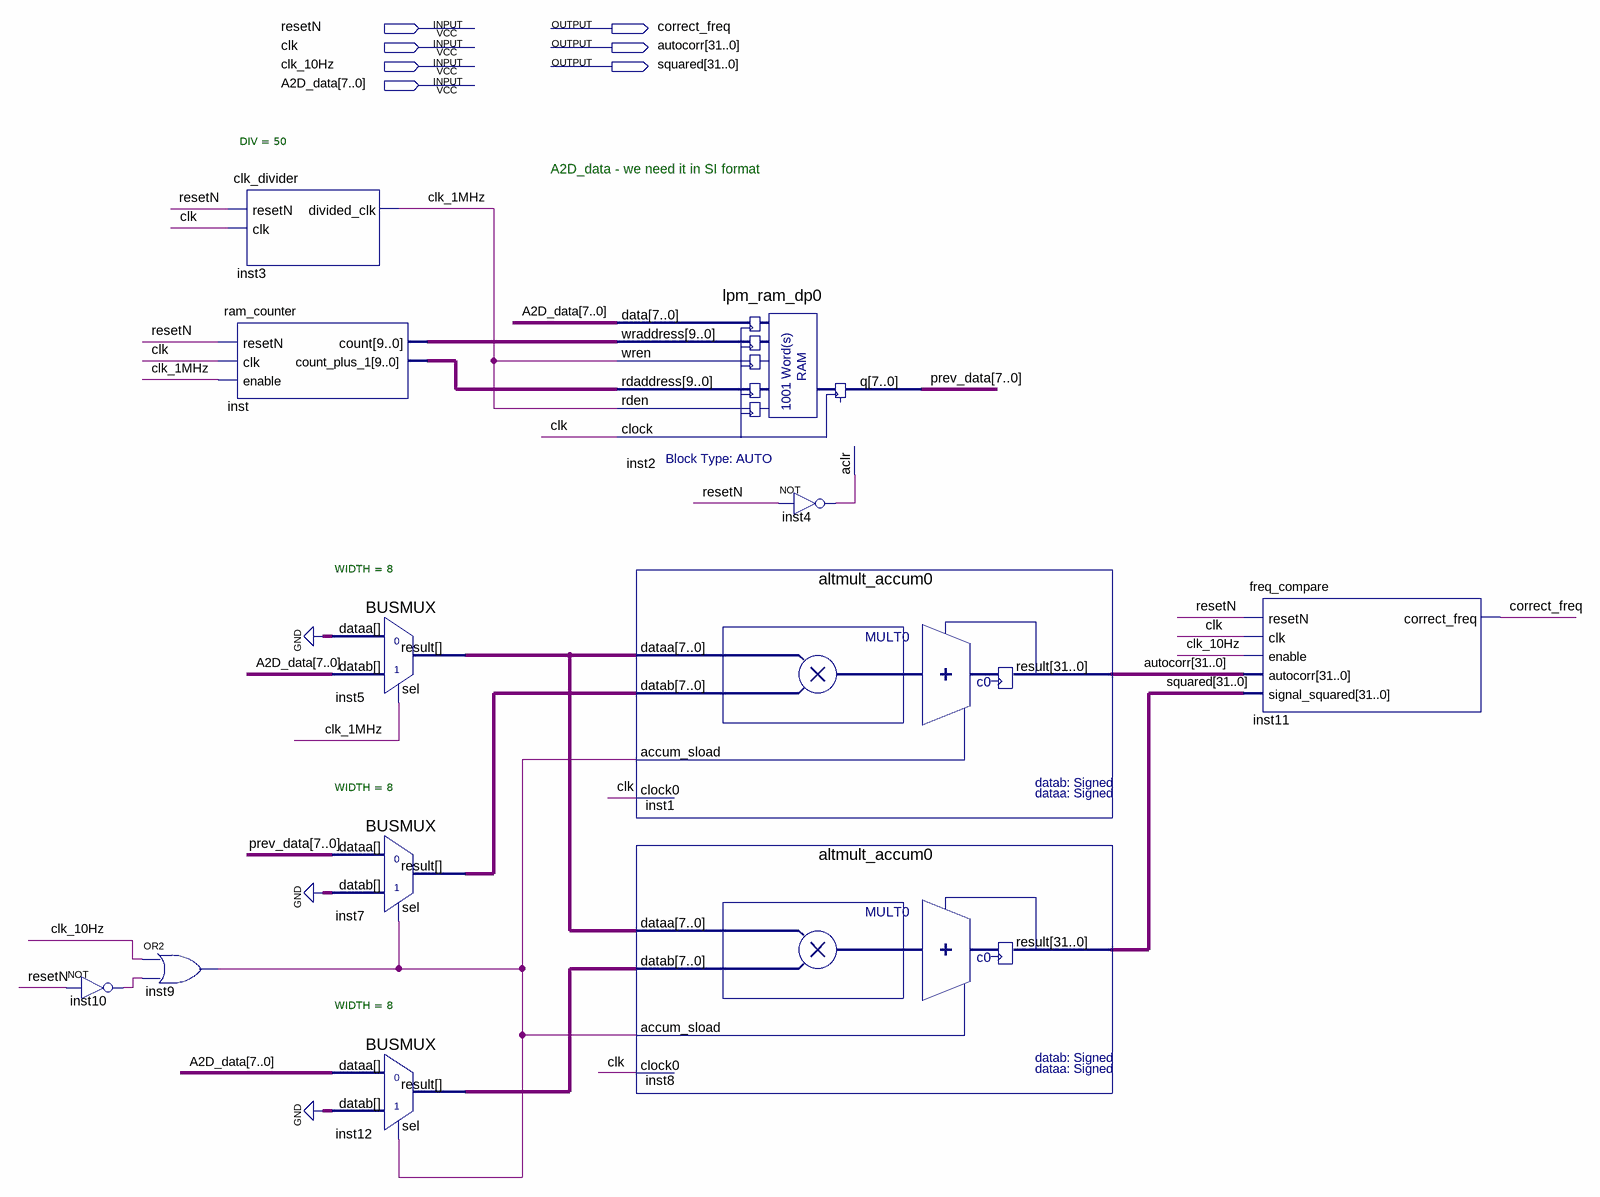
[diagram p0: schematic sheet]
// Quartus schematic freq_detector.bdf as structural Verilog: 12 symbols, 7 pins
module freq_detector (
  input  resetN,
  input  clk,
  input  clk_10Hz,
  input  [7:0] A2D_data,
  output correct_freq,
  output [31:0] autocorr,
  output [31:0] squared
);

  wire clk_1MHz, inst4_out, inst9_out, inst10_out;
  wire [7:0] inst5_result, inst7_result, inst12_result, prev_data;
  wire [9:0] inst_count, inst_count_plus_1;

  not inst10 (inst10_out, resetN);
  or inst9 (inst9_out, clk_10Hz, inst10_out);
  clk_divider #(.DIV(50)) inst3 (.resetN(resetN), .clk(clk), .divided_clk(clk_1MHz));
  ram_counter inst (
    .resetN(resetN), .clk(clk), .enable(clk_1MHz), .count(inst_count), .count_plus_1(inst_count_plus_1));
  BUSMUX #(.WIDTH(8)) inst5 (.datab(A2D_data), .sel(clk_1MHz), .dataa({8{1'b0}}), .result(inst5_result));
  BUSMUX #(.WIDTH(8)) inst7 (.datab({8{1'b0}}), .sel(inst9_out), .dataa(prev_data), .result(inst7_result));
  BUSMUX #(.WIDTH(8)) inst12 (.datab({8{1'b0}}), .sel(inst9_out), .dataa(A2D_data), .result(inst12_result));
  lpm_ram_dp0 inst2 (
    .data(A2D_data), .wraddress(inst_count), .wren(clk_1MHz), .rdaddress(inst_count_plus_1), .rden(clk_1MHz),
    .clock(clk), .aclr(inst4_out), .q(prev_data));
  altmult_accum0 inst1 (
    .dataa(inst5_result), .datab(inst7_result), .accum_sload(inst9_out), .clock0(clk), .result(autocorr));
  altmult_accum0 inst8 (
    .dataa(inst5_result), .datab(inst12_result), .accum_sload(inst9_out), .clock0(clk), .result(squared));
  not inst4 (inst4_out, resetN);
  freq_compare inst11 (
    .resetN(resetN), .clk(clk), .enable(clk_10Hz), .autocorr(autocorr), .signal_squared(squared),
    .correct_freq(correct_freq));

  // Notes on the sheet:
  //   A2D_data - we need it in SI format
endmodule
